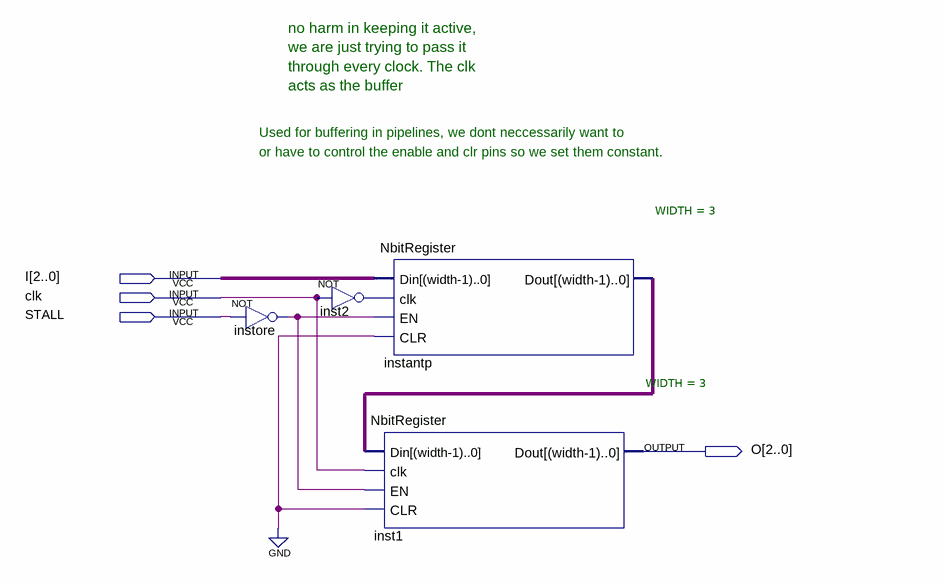
[diagram p0: schematic sheet]
// Quartus schematic 3bitPSR.bdf as structural Verilog: 4 symbols, 4 pins
module \3bitPSR  (
  input  [2:0] I,
  input  clk,
  input  STALL,
  output [2:0] O
);

  wire inst2_out, instore_out;
  wire [2:0] instantp_dout;

  not instore (instore_out, STALL);
  not inst2 (inst2_out, clk);
  NbitRegister #(.WIDTH(3)) inst1 (.Din(instantp_dout), .clk(clk), .EN(instore_out), .CLR(1'b0), .Dout(O));
  NbitRegister #(.WIDTH(3)) instantp (.Din(I), .clk(inst2_out), .EN(instore_out), .CLR(1'b0), .Dout(instantp_dout));

  // Notes on the sheet:
  //   no harm in keeping it active,
  //   we are just trying to pass it
  //   through every clock. The clk
  //   acts as the buffer
  //   Used for buffering in pipelines, we dont neccessarily want to
  //   or have to control the enable and clr pins so we set them constant.
endmodule
